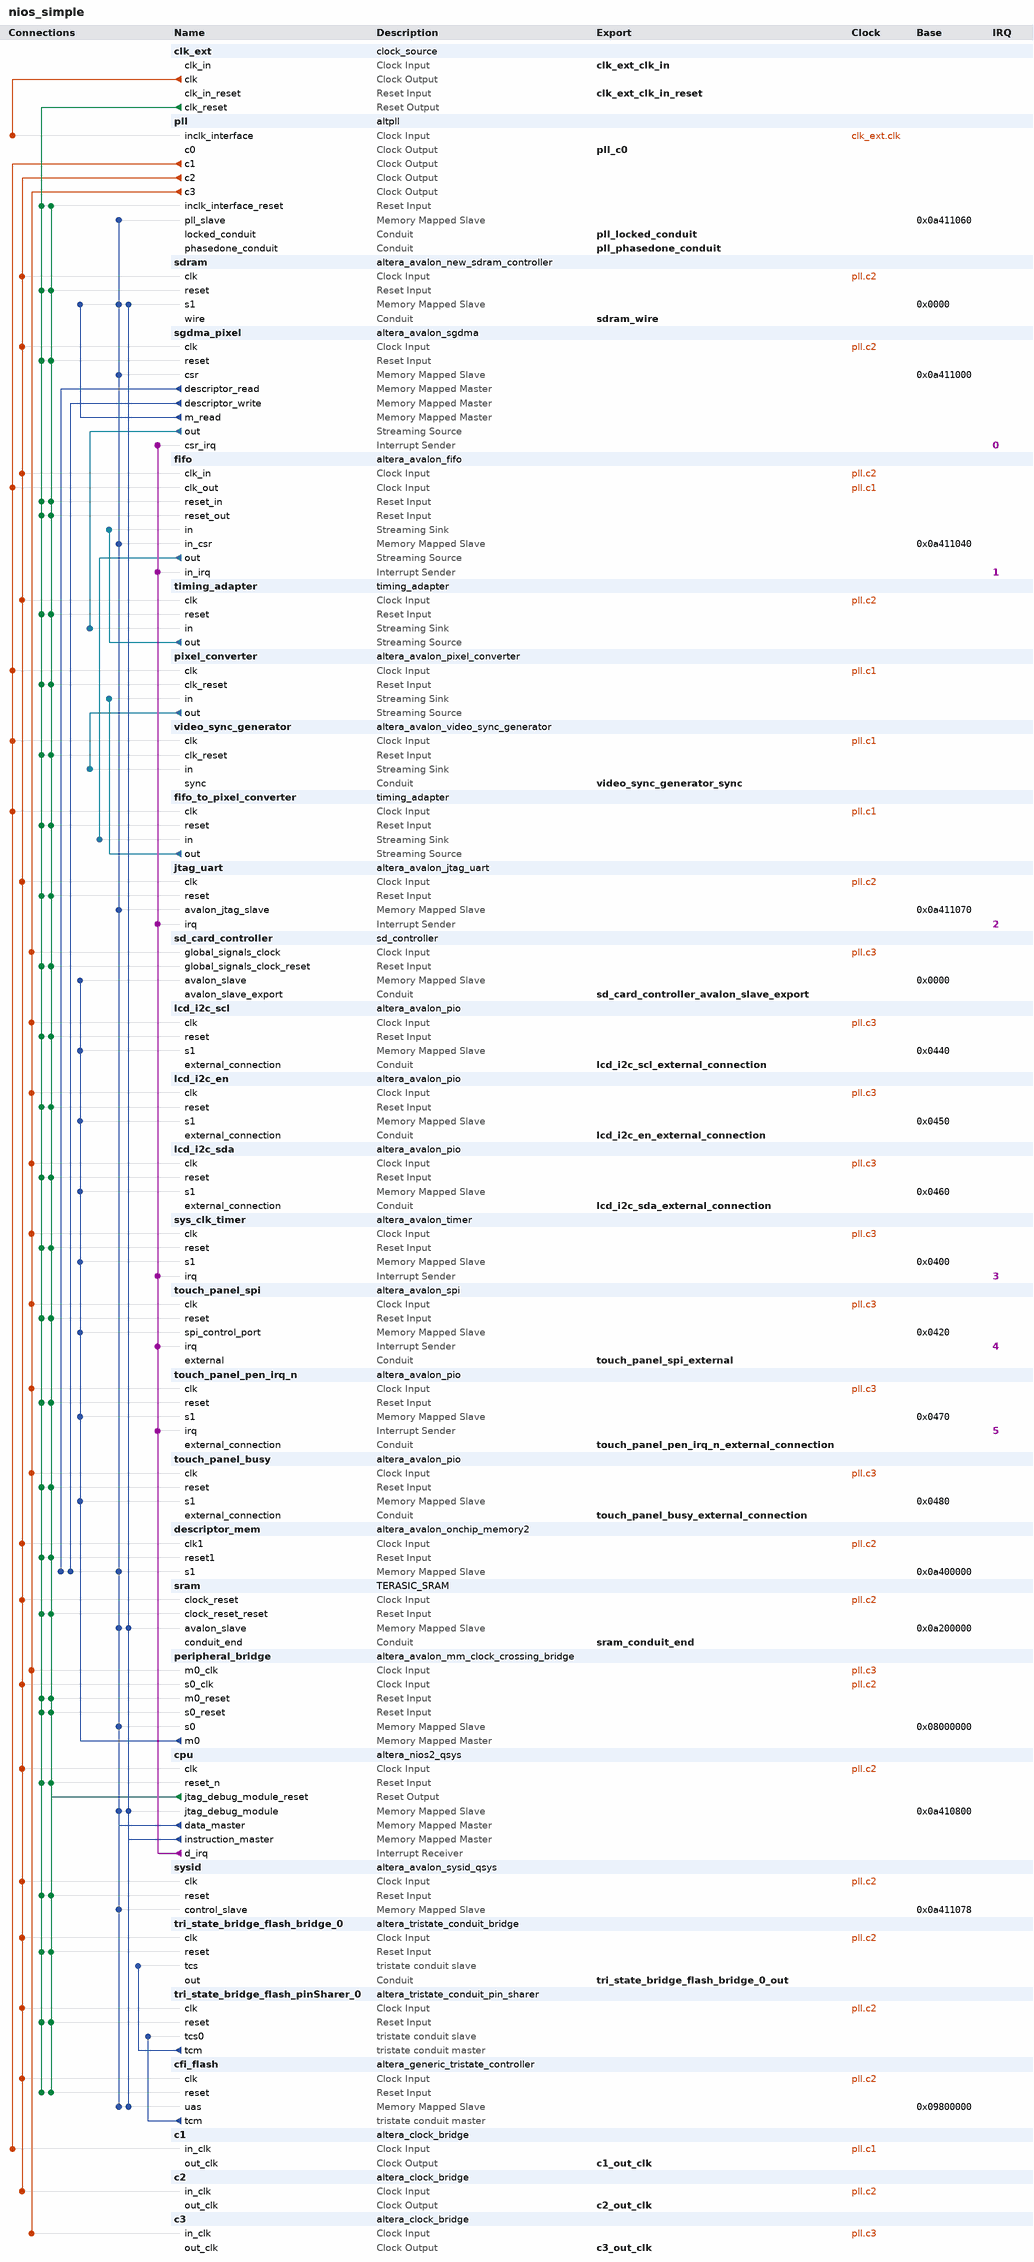
[diagram p0: system contents]
# Platform Designer (Qsys) system nios_simple, Cyclone IV E EP4CE115F29C8
# Parameters at their usual value, and those the tool derives, are not listed.
package require -exact qsys 13.0
create_system nios_simple
set_project_property DEVICE_FAMILY {Cyclone IV E}
set_project_property DEVICE EP4CE115F29C8

add_instance clk_ext clock_source 13.0
set_instance_parameter_value clk_ext clockFrequency 50000000

add_instance pll altpll 13.0
set_instance_parameter_value pll INCLK0_INPUT_FREQUENCY 20000
set_instance_parameter_value pll CLK0_MULTIPLY_BY 2
set_instance_parameter_value pll CLK1_MULTIPLY_BY 2
set_instance_parameter_value pll CLK2_MULTIPLY_BY 2
set_instance_parameter_value pll CLK3_MULTIPLY_BY 8
set_instance_parameter_value pll CLK0_DIVIDE_BY 1
set_instance_parameter_value pll CLK1_DIVIDE_BY 3
set_instance_parameter_value pll CLK2_DIVIDE_BY 1
set_instance_parameter_value pll CLK3_DIVIDE_BY 5
set_instance_parameter_value pll CLK0_PHASE_SHIFT -1806
set_instance_parameter_value pll CLK1_PHASE_SHIFT 0
set_instance_parameter_value pll CLK2_PHASE_SHIFT 0
set_instance_parameter_value pll CLK3_PHASE_SHIFT 0
set_instance_parameter_value pll CLK1_DUTY_CYCLE 50
set_instance_parameter_value pll CLK2_DUTY_CYCLE 50
set_instance_parameter_value pll CLK3_DUTY_CYCLE 50
set_instance_parameter_value pll PORT_clk1 PORT_USED
set_instance_parameter_value pll PORT_clk2 PORT_USED
set_instance_parameter_value pll PORT_clk3 PORT_USED
set_instance_parameter_value pll PORT_ARESET PORT_UNUSED
set_instance_parameter_value pll PORT_LOCKED PORT_UNUSED

add_instance sdram altera_avalon_new_sdram_controller 13.0.1.99.2
set_instance_parameter_value sdram TAC 5.5
set_instance_parameter_value sdram TRCD 20.0
set_instance_parameter_value sdram TRP 20.0
set_instance_parameter_value sdram casLatency 3
set_instance_parameter_value sdram columnWidth 10
set_instance_parameter_value sdram dataWidth 32
set_instance_parameter_value sdram generateSimulationModel true
set_instance_parameter_value sdram model custom
set_instance_parameter_value sdram numberOfBanks 4
set_instance_parameter_value sdram numberOfChipSelects 1
set_instance_parameter_value sdram powerUpDelay 100.0
set_instance_parameter_value sdram refreshPeriod 15.625
set_instance_parameter_value sdram rowWidth 13

add_instance sgdma_pixel altera_avalon_sgdma 13.0.1.99.2
set_instance_parameter_value sgdma_pixel enableBurstTransfers false
set_instance_parameter_value sgdma_pixel enableUnalignedTransfers false
set_instance_parameter_value sgdma_pixel readBlockDataWidth 32
set_instance_parameter_value sgdma_pixel sinkErrorWidth 0
set_instance_parameter_value sgdma_pixel sourceErrorWidth 0
set_instance_parameter_value sgdma_pixel transferMode MEMORY_TO_STREAM
set_instance_parameter_value sgdma_pixel writeBurstcountWidth 4

add_instance fifo altera_avalon_fifo 13.0.1.99.2
set_instance_parameter_value fifo bitsPerSymbol 8
set_instance_parameter_value fifo channelWidth 0
set_instance_parameter_value fifo errorWidth 0
set_instance_parameter_value fifo fifoDepth 512
set_instance_parameter_value fifo fifoInputInterfaceOptions AVALONST_SINK
set_instance_parameter_value fifo fifoOutputInterfaceOptions AVALONST_SOURCE
set_instance_parameter_value fifo singleClockMode false
set_instance_parameter_value fifo symbolsPerBeat 4
set_instance_parameter_value fifo useIRQ true
set_instance_parameter_value fifo usePacket true
set_instance_parameter_value fifo useReadControl false

add_instance timing_adapter timing_adapter 13.0
set_instance_parameter_value timing_adapter inBitsPerSymbol 8
set_instance_parameter_value timing_adapter inChannelWidth 0
set_instance_parameter_value timing_adapter inErrorWidth 0
set_instance_parameter_value timing_adapter inMaxChannel 0
set_instance_parameter_value timing_adapter inReadyLatency 0
set_instance_parameter_value timing_adapter inSymbolsPerBeat 4
set_instance_parameter_value timing_adapter inUseEmptyPort YES
set_instance_parameter_value timing_adapter inUsePackets true
set_instance_parameter_value timing_adapter inUseReady true
set_instance_parameter_value timing_adapter inUseValid true
set_instance_parameter_value timing_adapter outReadyLatency 1
set_instance_parameter_value timing_adapter outUseReady true
set_instance_parameter_value timing_adapter outUseValid true

add_instance pixel_converter altera_avalon_pixel_converter 13.0
set_instance_parameter_value pixel_converter SOURCE_SYMBOLS_PER_BEAT 1

add_instance video_sync_generator altera_avalon_video_sync_generator 13.0
set_instance_parameter_value video_sync_generator DATA_STREAM_BIT_WIDTH 24
set_instance_parameter_value video_sync_generator BEATS_PER_PIXEL 1
set_instance_parameter_value video_sync_generator NUM_COLUMNS 800
set_instance_parameter_value video_sync_generator NUM_ROWS 480
set_instance_parameter_value video_sync_generator H_BLANK_PIXELS 216
set_instance_parameter_value video_sync_generator H_FRONT_PORCH_PIXELS 40
set_instance_parameter_value video_sync_generator H_SYNC_PULSE_PIXELS 1
set_instance_parameter_value video_sync_generator H_SYNC_PULSE_POLARITY 0
set_instance_parameter_value video_sync_generator V_BLANK_LINES 35
set_instance_parameter_value video_sync_generator V_FRONT_PORCH_LINES 10
set_instance_parameter_value video_sync_generator V_SYNC_PULSE_LINES 1
set_instance_parameter_value video_sync_generator V_SYNC_PULSE_POLARITY 0
set_instance_parameter_value video_sync_generator TOTAL_HSCAN_PIXELS 1056
set_instance_parameter_value video_sync_generator TOTAL_VSCAN_LINES 525

add_instance fifo_to_pixel_converter timing_adapter 13.0
set_instance_parameter_value fifo_to_pixel_converter inBitsPerSymbol 8
set_instance_parameter_value fifo_to_pixel_converter inChannelWidth 0
set_instance_parameter_value fifo_to_pixel_converter inErrorWidth 0
set_instance_parameter_value fifo_to_pixel_converter inMaxChannel 0
set_instance_parameter_value fifo_to_pixel_converter inReadyLatency 1
set_instance_parameter_value fifo_to_pixel_converter inSymbolsPerBeat 4
set_instance_parameter_value fifo_to_pixel_converter inUseEmptyPort YES
set_instance_parameter_value fifo_to_pixel_converter inUsePackets true
set_instance_parameter_value fifo_to_pixel_converter inUseReady true
set_instance_parameter_value fifo_to_pixel_converter inUseValid true
set_instance_parameter_value fifo_to_pixel_converter outReadyLatency 0
set_instance_parameter_value fifo_to_pixel_converter outUseReady true
set_instance_parameter_value fifo_to_pixel_converter outUseValid true

add_instance jtag_uart altera_avalon_jtag_uart 13.0.1.99.2
set_instance_parameter_value jtag_uart simInteractiveOptions INTERACTIVE_ASCII_OUTPUT

add_instance sd_card_controller sd_controller 8.0
set_instance_parameter_value sd_card_controller IDLE 0
set_instance_parameter_value sd_card_controller SHIFT_OUT_CMD 1
set_instance_parameter_value sd_card_controller WAIT_FOR_RSP_START 2
set_instance_parameter_value sd_card_controller SHIFT_IN_CMD_RSP 3
set_instance_parameter_value sd_card_controller WAIT_FOR_DATA_START 4
set_instance_parameter_value sd_card_controller SHIFT_IN_DATA 5
set_instance_parameter_value sd_card_controller SHIFT_IN_CRC16 6
set_instance_parameter_value sd_card_controller SHIFT_OUT_DATA_TOKEN 7
set_instance_parameter_value sd_card_controller SHIFT_OUT_DATA 8
set_instance_parameter_value sd_card_controller SHIFT_OUT_CRC16 9
set_instance_parameter_value sd_card_controller SHIFT_IN_DATA_RSP 10
set_instance_parameter_value sd_card_controller DATA_BUSY 11
set_instance_parameter_value sd_card_controller ERROR_STATE 12
set_instance_parameter_value sd_card_controller WAIT 13

add_instance lcd_i2c_scl altera_avalon_pio 13.0.1.99.2
set_instance_parameter_value lcd_i2c_scl direction Output
set_instance_parameter_value lcd_i2c_scl width 1

add_instance lcd_i2c_en altera_avalon_pio 13.0.1.99.2
set_instance_parameter_value lcd_i2c_en direction Output
set_instance_parameter_value lcd_i2c_en width 1

add_instance lcd_i2c_sda altera_avalon_pio 13.0.1.99.2
set_instance_parameter_value lcd_i2c_sda direction Bidir
set_instance_parameter_value lcd_i2c_sda width 1

add_instance sys_clk_timer altera_avalon_timer 13.0.1.99.2
set_instance_parameter_value sys_clk_timer period 10
set_instance_parameter_value sys_clk_timer periodUnits MSEC

add_instance touch_panel_spi altera_avalon_spi 13.0.1.99.2
set_instance_parameter_value touch_panel_spi clockPolarity 0
set_instance_parameter_value touch_panel_spi dataWidth 8
set_instance_parameter_value touch_panel_spi masterSPI true
set_instance_parameter_value touch_panel_spi numberOfSlaves 1
set_instance_parameter_value touch_panel_spi targetClockRate 32000

add_instance touch_panel_pen_irq_n altera_avalon_pio 13.0.1.99.2
set_instance_parameter_value touch_panel_pen_irq_n captureEdge true
set_instance_parameter_value touch_panel_pen_irq_n direction Input
set_instance_parameter_value touch_panel_pen_irq_n edgeType FALLING
set_instance_parameter_value touch_panel_pen_irq_n generateIRQ true
set_instance_parameter_value touch_panel_pen_irq_n irqType EDGE
set_instance_parameter_value touch_panel_pen_irq_n width 1

add_instance touch_panel_busy altera_avalon_pio 13.0.1.99.2
set_instance_parameter_value touch_panel_busy direction Input
set_instance_parameter_value touch_panel_busy width 1

add_instance descriptor_mem altera_avalon_onchip_memory2 13.0.1.99.2
set_instance_parameter_value descriptor_mem dataWidth 32
set_instance_parameter_value descriptor_mem dualPort false
set_instance_parameter_value descriptor_mem initMemContent true
set_instance_parameter_value descriptor_mem initializationFileName descriptor_mem
set_instance_parameter_value descriptor_mem memorySize 65536

add_instance sram TERASIC_SRAM 1.0
set_instance_parameter_value sram DATA_BITS 16
set_instance_parameter_value sram ADDR_BITS 20

add_instance peripheral_bridge altera_avalon_mm_clock_crossing_bridge 13.0
set_instance_parameter_value peripheral_bridge DATA_WIDTH 32
set_instance_parameter_value peripheral_bridge ADDRESS_WIDTH 11
set_instance_parameter_value peripheral_bridge MAX_BURST_SIZE 1
set_instance_parameter_value peripheral_bridge COMMAND_FIFO_DEPTH 32
set_instance_parameter_value peripheral_bridge RESPONSE_FIFO_DEPTH 64
set_instance_parameter_value peripheral_bridge MASTER_SYNC_DEPTH 3
set_instance_parameter_value peripheral_bridge SLAVE_SYNC_DEPTH 3

add_instance cpu altera_nios2_qsys 13.0
set_instance_parameter_value cpu manuallyAssignCpuID false
set_instance_parameter_value cpu resetSlave cfi_flash.uas
set_instance_parameter_value cpu exceptionSlave sram.avalon_slave
set_instance_parameter_value cpu breakSlave cpu.jtag_debug_module
set_instance_parameter_value cpu impl Fast
set_instance_parameter_value cpu icache_size 4096

add_instance sysid altera_avalon_sysid_qsys 13.0
set_instance_parameter_value sysid id 0

add_instance tri_state_bridge_flash_bridge_0 altera_tristate_conduit_bridge 13.0

add_instance tri_state_bridge_flash_pinSharer_0 altera_tristate_conduit_pin_sharer 13.0
set_instance_parameter_value tri_state_bridge_flash_pinSharer_0 NUM_INTERFACES 1
set_instance_parameter_value tri_state_bridge_flash_pinSharer_0 MODULE_ORIGIN_LIST cfi_flash.tcm,cfi_flash.tcm,cfi_flash.tcm,cfi_flash.tcm,cfi_flash.tcm
set_instance_parameter_value tri_state_bridge_flash_pinSharer_0 SHARED_SIGNAL_LIST tri_state_bridge_flash_address,read_n_to_the_cfi_flash,write_n_to_the_cfi_flash,tri_state_bridge_flash_data,select_n_to_the_cfi_flash

add_instance cfi_flash altera_generic_tristate_controller 13.0
set_instance_parameter_value cfi_flash TCM_ADDRESS_W 23
set_instance_parameter_value cfi_flash TCM_DATA_W 8
set_instance_parameter_value cfi_flash TCM_BYTEENABLE_W 1
set_instance_parameter_value cfi_flash TCM_READ_WAIT 160
set_instance_parameter_value cfi_flash TCM_WRITE_WAIT 160
set_instance_parameter_value cfi_flash TCM_SETUP_WAIT 60
set_instance_parameter_value cfi_flash TCM_DATA_HOLD 60
set_instance_parameter_value cfi_flash TCM_MAX_PENDING_READ_TRANSACTIONS 3
set_instance_parameter_value cfi_flash TCM_TURNAROUND_TIME 2
set_instance_parameter_value cfi_flash TCM_TIMING_UNITS 0
set_instance_parameter_value cfi_flash TCM_READLATENCY 2
set_instance_parameter_value cfi_flash TCM_SYMBOLS_PER_WORD 1
set_instance_parameter_value cfi_flash USE_READ 1
set_instance_parameter_value cfi_flash USE_BEGINTRANSFER 0
set_instance_parameter_value cfi_flash USE_BYTEENABLE 0
set_instance_parameter_value cfi_flash USE_OUTPUTENABLE 0
set_instance_parameter_value cfi_flash ACTIVE_LOW_READ 1
set_instance_parameter_value cfi_flash ACTIVE_LOW_BYTEENABLE 0
set_instance_parameter_value cfi_flash ACTIVE_LOW_OUTPUTENABLE 0
set_instance_parameter_value cfi_flash ACTIVE_LOW_BEGINTRANSFER 0
set_instance_parameter_value cfi_flash CHIPSELECT_THROUGH_READLATENCY 0
set_instance_parameter_value cfi_flash MODULE_ASSIGNMENT_KEYS embeddedsw.configuration.hwClassnameDriverSupportList,embeddedsw.configuration.hwClassnameDriverSupportDefault,embeddedsw.CMacro.SETUP_VALUE,embeddedsw.CMacro.WAIT_VALUE,embeddedsw.CMacro.HOLD_VALUE,embeddedsw.CMacro.TIMING_UNITS,embeddedsw.CMacro.SIZE,embeddedsw.memoryInfo.MEM_INIT_DATA_WIDTH,embeddedsw.memoryInfo.HAS_BYTE_LANE,embeddedsw.memoryInfo.IS_FLASH,embeddedsw.memoryInfo.GENERATE_DAT_SYM,embeddedsw.memoryInfo.GENERATE_FLASH,embeddedsw.memoryInfo.DAT_SYM_INSTALL_DIR,embeddedsw.memoryInfo.FLASH_INSTALL_DIR
set_instance_parameter_value cfi_flash MODULE_ASSIGNMENT_VALUES {altera_avalon_lan91c111:altera_avalon_cfi_flash,altera_avalon_cfi_flash,60,160,60,"ns",8388608u,8,0,1,1,1,SIM_DIR,APP_DIR}
set_instance_parameter_value cfi_flash INTERFACE_ASSIGNMENT_KEYS embeddedsw.configuration.isFlash,embeddedsw.configuration.isMemoryDevice,embeddedsw.configuration.isNonVolatileStorage
set_instance_parameter_value cfi_flash INTERFACE_ASSIGNMENT_VALUES 1,1,1

add_instance c1 altera_clock_bridge 13.0
set_instance_parameter_value c1 DERIVED_CLOCK_RATE 33333332
set_instance_parameter_value c1 EXPLICIT_CLOCK_RATE 0

add_instance c2 altera_clock_bridge 13.0
set_instance_parameter_value c2 DERIVED_CLOCK_RATE 100000000
set_instance_parameter_value c2 EXPLICIT_CLOCK_RATE 0

add_instance c3 altera_clock_bridge 13.0
set_instance_parameter_value c3 DERIVED_CLOCK_RATE 80000000
set_instance_parameter_value c3 EXPLICIT_CLOCK_RATE 0

# connections
add_connection clk_ext.clk pll.inclk_interface clock
add_connection pll.c1 c1.in_clk clock
add_connection pll.c1 fifo.clk_out clock
add_connection pll.c1 fifo_to_pixel_converter.clk clock
add_connection pll.c1 pixel_converter.clk clock
add_connection pll.c1 video_sync_generator.clk clock
add_connection pll.c2 c2.in_clk clock
add_connection pll.c2 cfi_flash.clk clock
add_connection pll.c2 cpu.clk clock
add_connection pll.c2 descriptor_mem.clk1 clock
add_connection pll.c2 fifo.clk_in clock
add_connection pll.c2 jtag_uart.clk clock
add_connection pll.c2 peripheral_bridge.s0_clk clock
add_connection pll.c2 sdram.clk clock
add_connection pll.c2 sgdma_pixel.clk clock
add_connection pll.c2 sram.clock_reset clock
add_connection pll.c2 sysid.clk clock
add_connection pll.c2 timing_adapter.clk clock
add_connection pll.c2 tri_state_bridge_flash_bridge_0.clk clock
add_connection pll.c2 tri_state_bridge_flash_pinSharer_0.clk clock
add_connection pll.c3 c3.in_clk clock
add_connection pll.c3 lcd_i2c_en.clk clock
add_connection pll.c3 lcd_i2c_scl.clk clock
add_connection pll.c3 lcd_i2c_sda.clk clock
add_connection pll.c3 peripheral_bridge.m0_clk clock
add_connection pll.c3 sd_card_controller.global_signals_clock clock
add_connection pll.c3 sys_clk_timer.clk clock
add_connection pll.c3 touch_panel_busy.clk clock
add_connection pll.c3 touch_panel_pen_irq_n.clk clock
add_connection pll.c3 touch_panel_spi.clk clock
add_connection clk_ext.clk_reset cfi_flash.reset reset
add_connection clk_ext.clk_reset cpu.reset_n reset
add_connection clk_ext.clk_reset descriptor_mem.reset1 reset
add_connection clk_ext.clk_reset fifo.reset_in reset
add_connection clk_ext.clk_reset fifo.reset_out reset
add_connection clk_ext.clk_reset fifo_to_pixel_converter.reset reset
add_connection clk_ext.clk_reset jtag_uart.reset reset
add_connection clk_ext.clk_reset lcd_i2c_en.reset reset
add_connection clk_ext.clk_reset lcd_i2c_scl.reset reset
add_connection clk_ext.clk_reset lcd_i2c_sda.reset reset
add_connection clk_ext.clk_reset peripheral_bridge.m0_reset reset
add_connection clk_ext.clk_reset peripheral_bridge.s0_reset reset
add_connection clk_ext.clk_reset pixel_converter.clk_reset reset
add_connection clk_ext.clk_reset pll.inclk_interface_reset reset
add_connection clk_ext.clk_reset sd_card_controller.global_signals_clock_reset reset
add_connection clk_ext.clk_reset sdram.reset reset
add_connection clk_ext.clk_reset sgdma_pixel.reset reset
add_connection clk_ext.clk_reset sram.clock_reset_reset reset
add_connection clk_ext.clk_reset sys_clk_timer.reset reset
add_connection clk_ext.clk_reset sysid.reset reset
add_connection clk_ext.clk_reset timing_adapter.reset reset
add_connection clk_ext.clk_reset touch_panel_busy.reset reset
add_connection clk_ext.clk_reset touch_panel_pen_irq_n.reset reset
add_connection clk_ext.clk_reset touch_panel_spi.reset reset
add_connection clk_ext.clk_reset tri_state_bridge_flash_bridge_0.reset reset
add_connection clk_ext.clk_reset tri_state_bridge_flash_pinSharer_0.reset reset
add_connection clk_ext.clk_reset video_sync_generator.clk_reset reset
add_connection cpu.jtag_debug_module_reset cfi_flash.reset reset
add_connection cpu.jtag_debug_module_reset cpu.reset_n reset
add_connection cpu.jtag_debug_module_reset descriptor_mem.reset1 reset
add_connection cpu.jtag_debug_module_reset fifo.reset_in reset
add_connection cpu.jtag_debug_module_reset fifo.reset_out reset
add_connection cpu.jtag_debug_module_reset fifo_to_pixel_converter.reset reset
add_connection cpu.jtag_debug_module_reset jtag_uart.reset reset
add_connection cpu.jtag_debug_module_reset lcd_i2c_en.reset reset
add_connection cpu.jtag_debug_module_reset lcd_i2c_scl.reset reset
add_connection cpu.jtag_debug_module_reset lcd_i2c_sda.reset reset
add_connection cpu.jtag_debug_module_reset peripheral_bridge.m0_reset reset
add_connection cpu.jtag_debug_module_reset peripheral_bridge.s0_reset reset
add_connection cpu.jtag_debug_module_reset pixel_converter.clk_reset reset
add_connection cpu.jtag_debug_module_reset pll.inclk_interface_reset reset
add_connection cpu.jtag_debug_module_reset sd_card_controller.global_signals_clock_reset reset
add_connection cpu.jtag_debug_module_reset sdram.reset reset
add_connection cpu.jtag_debug_module_reset sgdma_pixel.reset reset
add_connection cpu.jtag_debug_module_reset sram.clock_reset_reset reset
add_connection cpu.jtag_debug_module_reset sys_clk_timer.reset reset
add_connection cpu.jtag_debug_module_reset sysid.reset reset
add_connection cpu.jtag_debug_module_reset timing_adapter.reset reset
add_connection cpu.jtag_debug_module_reset touch_panel_busy.reset reset
add_connection cpu.jtag_debug_module_reset touch_panel_pen_irq_n.reset reset
add_connection cpu.jtag_debug_module_reset touch_panel_spi.reset reset
add_connection cpu.jtag_debug_module_reset tri_state_bridge_flash_bridge_0.reset reset
add_connection cpu.jtag_debug_module_reset tri_state_bridge_flash_pinSharer_0.reset reset
add_connection cpu.jtag_debug_module_reset video_sync_generator.clk_reset reset
add_connection cpu.data_master cfi_flash.uas avalon
set_connection_parameter_value cpu.data_master/cfi_flash.uas baseAddress 0x09800000
add_connection cpu.data_master cpu.jtag_debug_module avalon
set_connection_parameter_value cpu.data_master/cpu.jtag_debug_module baseAddress 0x0a410800
add_connection cpu.data_master descriptor_mem.s1 avalon
set_connection_parameter_value cpu.data_master/descriptor_mem.s1 baseAddress 0x0a400000
add_connection cpu.data_master fifo.in_csr avalon
set_connection_parameter_value cpu.data_master/fifo.in_csr baseAddress 0x0a411040
add_connection cpu.data_master jtag_uart.avalon_jtag_slave avalon
set_connection_parameter_value cpu.data_master/jtag_uart.avalon_jtag_slave baseAddress 0x0a411070
add_connection cpu.data_master peripheral_bridge.s0 avalon
set_connection_parameter_value cpu.data_master/peripheral_bridge.s0 baseAddress 0x08000000
add_connection cpu.data_master pll.pll_slave avalon
set_connection_parameter_value cpu.data_master/pll.pll_slave baseAddress 0x0a411060
add_connection cpu.data_master sdram.s1 avalon
set_connection_parameter_value cpu.data_master/sdram.s1 baseAddress 0x0000
add_connection cpu.data_master sgdma_pixel.csr avalon
set_connection_parameter_value cpu.data_master/sgdma_pixel.csr baseAddress 0x0a411000
add_connection cpu.data_master sram.avalon_slave avalon
set_connection_parameter_value cpu.data_master/sram.avalon_slave baseAddress 0x0a200000
add_connection cpu.data_master sysid.control_slave avalon
set_connection_parameter_value cpu.data_master/sysid.control_slave baseAddress 0x0a411078
add_connection cpu.instruction_master cfi_flash.uas avalon
set_connection_parameter_value cpu.instruction_master/cfi_flash.uas baseAddress 0x09800000
add_connection cpu.instruction_master cpu.jtag_debug_module avalon
set_connection_parameter_value cpu.instruction_master/cpu.jtag_debug_module baseAddress 0x0a410800
add_connection cpu.instruction_master sdram.s1 avalon
set_connection_parameter_value cpu.instruction_master/sdram.s1 baseAddress 0x0000
add_connection cpu.instruction_master sram.avalon_slave avalon
set_connection_parameter_value cpu.instruction_master/sram.avalon_slave baseAddress 0x0a200000
add_connection peripheral_bridge.m0 lcd_i2c_en.s1 avalon
set_connection_parameter_value peripheral_bridge.m0/lcd_i2c_en.s1 baseAddress 0x0450
add_connection peripheral_bridge.m0 lcd_i2c_scl.s1 avalon
set_connection_parameter_value peripheral_bridge.m0/lcd_i2c_scl.s1 baseAddress 0x0440
add_connection peripheral_bridge.m0 lcd_i2c_sda.s1 avalon
set_connection_parameter_value peripheral_bridge.m0/lcd_i2c_sda.s1 baseAddress 0x0460
add_connection peripheral_bridge.m0 sd_card_controller.avalon_slave avalon
set_connection_parameter_value peripheral_bridge.m0/sd_card_controller.avalon_slave baseAddress 0x0000
add_connection peripheral_bridge.m0 sys_clk_timer.s1 avalon
set_connection_parameter_value peripheral_bridge.m0/sys_clk_timer.s1 baseAddress 0x0400
add_connection peripheral_bridge.m0 touch_panel_busy.s1 avalon
set_connection_parameter_value peripheral_bridge.m0/touch_panel_busy.s1 baseAddress 0x0480
add_connection peripheral_bridge.m0 touch_panel_pen_irq_n.s1 avalon
set_connection_parameter_value peripheral_bridge.m0/touch_panel_pen_irq_n.s1 baseAddress 0x0470
add_connection peripheral_bridge.m0 touch_panel_spi.spi_control_port avalon
set_connection_parameter_value peripheral_bridge.m0/touch_panel_spi.spi_control_port baseAddress 0x0420
add_connection sgdma_pixel.descriptor_read descriptor_mem.s1 avalon
set_connection_parameter_value sgdma_pixel.descriptor_read/descriptor_mem.s1 arbitrationPriority 10
set_connection_parameter_value sgdma_pixel.descriptor_read/descriptor_mem.s1 baseAddress 0x0a400000
add_connection sgdma_pixel.descriptor_write descriptor_mem.s1 avalon
set_connection_parameter_value sgdma_pixel.descriptor_write/descriptor_mem.s1 arbitrationPriority 10
set_connection_parameter_value sgdma_pixel.descriptor_write/descriptor_mem.s1 baseAddress 0x0a400000
add_connection sgdma_pixel.m_read sdram.s1 avalon
set_connection_parameter_value sgdma_pixel.m_read/sdram.s1 arbitrationPriority 10
set_connection_parameter_value sgdma_pixel.m_read/sdram.s1 baseAddress 0x0000
add_connection fifo.out fifo_to_pixel_converter.in avalon_streaming
add_connection fifo_to_pixel_converter.out pixel_converter.in avalon_streaming
add_connection pixel_converter.out video_sync_generator.in avalon_streaming
add_connection sgdma_pixel.out timing_adapter.in avalon_streaming
add_connection timing_adapter.out fifo.in avalon_streaming
add_connection cpu.d_irq fifo.in_irq interrupt
set_connection_parameter_value cpu.d_irq/fifo.in_irq irqNumber 1
add_connection cpu.d_irq jtag_uart.irq interrupt
set_connection_parameter_value cpu.d_irq/jtag_uart.irq irqNumber 2
add_connection cpu.d_irq sgdma_pixel.csr_irq interrupt
set_connection_parameter_value cpu.d_irq/sgdma_pixel.csr_irq irqNumber 0
add_connection cpu.d_irq sys_clk_timer.irq interrupt
set_connection_parameter_value cpu.d_irq/sys_clk_timer.irq irqNumber 3
add_connection cpu.d_irq touch_panel_pen_irq_n.irq interrupt
set_connection_parameter_value cpu.d_irq/touch_panel_pen_irq_n.irq irqNumber 5
add_connection cpu.d_irq touch_panel_spi.irq interrupt
set_connection_parameter_value cpu.d_irq/touch_panel_spi.irq irqNumber 4
add_connection cfi_flash.tcm tri_state_bridge_flash_pinSharer_0.tcs0 tristate_conduit
add_connection tri_state_bridge_flash_pinSharer_0.tcm tri_state_bridge_flash_bridge_0.tcs tristate_conduit

# exported interfaces
add_interface tri_state_bridge_flash_bridge_0_out conduit end
set_interface_property tri_state_bridge_flash_bridge_0_out EXPORT_OF tri_state_bridge_flash_bridge_0.out
add_interface clk_ext_clk_in_reset reset sink
set_interface_property clk_ext_clk_in_reset EXPORT_OF clk_ext.clk_in_reset
add_interface clk_ext_clk_in clock sink
set_interface_property clk_ext_clk_in EXPORT_OF clk_ext.clk_in
add_interface pll_c0 clock source
set_interface_property pll_c0 EXPORT_OF pll.c0
add_interface c1_out_clk clock source
set_interface_property c1_out_clk EXPORT_OF c1.out_clk
add_interface c2_out_clk clock source
set_interface_property c2_out_clk EXPORT_OF c2.out_clk
add_interface c3_out_clk clock source
set_interface_property c3_out_clk EXPORT_OF c3.out_clk
add_interface pll_locked_conduit conduit end
set_interface_property pll_locked_conduit EXPORT_OF pll.locked_conduit
add_interface pll_phasedone_conduit conduit end
set_interface_property pll_phasedone_conduit EXPORT_OF pll.phasedone_conduit
add_interface sdram_wire conduit end
set_interface_property sdram_wire EXPORT_OF sdram.wire
add_interface video_sync_generator_sync conduit end
set_interface_property video_sync_generator_sync EXPORT_OF video_sync_generator.sync
add_interface sd_card_controller_avalon_slave_export conduit end
set_interface_property sd_card_controller_avalon_slave_export EXPORT_OF sd_card_controller.avalon_slave_export
add_interface lcd_i2c_scl_external_connection conduit end
set_interface_property lcd_i2c_scl_external_connection EXPORT_OF lcd_i2c_scl.external_connection
add_interface lcd_i2c_en_external_connection conduit end
set_interface_property lcd_i2c_en_external_connection EXPORT_OF lcd_i2c_en.external_connection
add_interface lcd_i2c_sda_external_connection conduit end
set_interface_property lcd_i2c_sda_external_connection EXPORT_OF lcd_i2c_sda.external_connection
add_interface touch_panel_spi_external conduit end
set_interface_property touch_panel_spi_external EXPORT_OF touch_panel_spi.external
add_interface touch_panel_pen_irq_n_external_connection conduit end
set_interface_property touch_panel_pen_irq_n_external_connection EXPORT_OF touch_panel_pen_irq_n.external_connection
add_interface touch_panel_busy_external_connection conduit end
set_interface_property touch_panel_busy_external_connection EXPORT_OF touch_panel_busy.external_connection
add_interface sram_conduit_end conduit end
set_interface_property sram_conduit_end EXPORT_OF sram.conduit_end

set_interconnect_requirement {$system} qsys_mm.clockCrossingAdapter HANDSHAKE
set_interconnect_requirement {$system} qsys_mm.maxAdditionalLatency 0

save_system nios_simple.qsys
